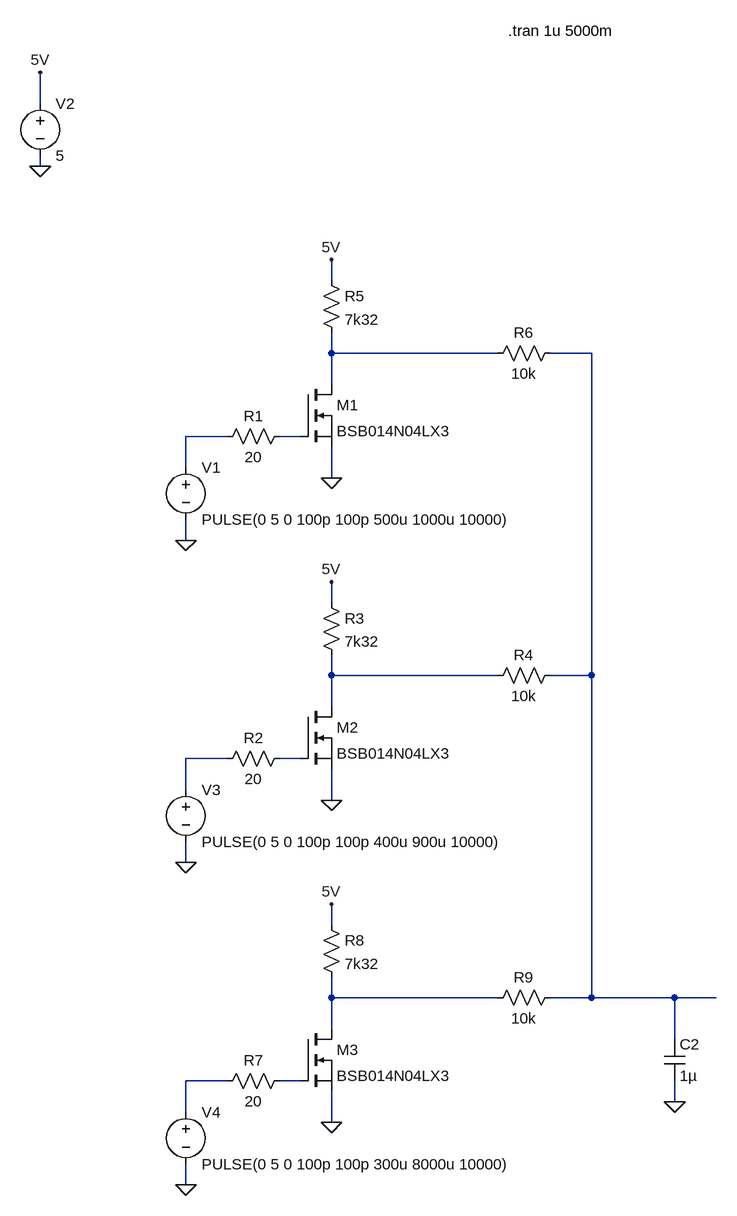
[diagram p0: schematic Fan Tachometer Combiner.asc]
Fan Tachometer Combiner.asc, the LTspice schematic file:
Version 4
SHEET 1 1076 1632
WIRE -176 -48 -176 -96
WIRE -176 48 -176 32
WIRE 272 224 272 192
WIRE 272 336 272 304
WIRE 528 336 272 336
WIRE 672 336 608 336
WIRE 272 384 272 336
WIRE 112 464 48 464
WIRE 224 464 192 464
WIRE 48 512 48 464
WIRE 272 528 272 480
WIRE 48 624 48 592
WIRE 272 720 272 688
WIRE 272 832 272 800
WIRE 528 832 272 832
WIRE 672 832 672 336
WIRE 672 832 608 832
WIRE 272 880 272 832
WIRE 112 960 48 960
WIRE 224 960 192 960
WIRE 48 1008 48 960
WIRE 272 1024 272 976
WIRE 48 1120 48 1088
WIRE 272 1216 272 1184
WIRE 272 1328 272 1296
WIRE 528 1328 272 1328
WIRE 672 1328 672 832
WIRE 672 1328 608 1328
WIRE 800 1328 672 1328
WIRE 864 1328 800 1328
WIRE 272 1376 272 1328
WIRE 800 1392 800 1328
WIRE 112 1456 48 1456
WIRE 224 1456 192 1456
WIRE 800 1488 800 1456
WIRE 48 1504 48 1456
WIRE 272 1520 272 1472
WIRE 48 1616 48 1584
FLAG 48 624 0
FLAG 272 528 0
FLAG -176 48 0
FLAG 800 1488 0
FLAG 48 1120 0
FLAG 272 1024 0
FLAG 48 1616 0
FLAG 272 1520 0
FLAG -176 -96 5V
FLAG 272 192 5V
FLAG 272 688 5V
FLAG 272 1184 5V
SYMBOL voltage 48 496 R0
SYMATTR InstName V1
SYMATTR Value PULSE(0 5 0 100p 100p 500u 1000u 10000)
SYMBOL nmos 224 384 R0
SYMATTR InstName M1
SYMATTR Value BSB014N04LX3
SYMBOL voltage -176 -64 R0
SYMATTR InstName V2
SYMATTR Value 5
SYMBOL cap 784 1392 R0
SYMATTR InstName C2
SYMATTR Value 1µ
SYMBOL res 208 448 R90
WINDOW 0 0 56 VBottom 2
WINDOW 3 32 56 VTop 2
SYMATTR InstName R1
SYMATTR Value 20
SYMBOL res 256 208 R0
SYMATTR InstName R5
SYMATTR Value 7k32
SYMBOL res 624 320 R90
WINDOW 0 0 56 VBottom 2
WINDOW 3 32 56 VTop 2
SYMATTR InstName R6
SYMATTR Value 10k
SYMBOL voltage 48 992 R0
SYMATTR InstName V3
SYMATTR Value PULSE(0 5 0 100p 100p 400u 900u 10000)
SYMBOL nmos 224 880 R0
SYMATTR InstName M2
SYMATTR Value BSB014N04LX3
SYMBOL res 208 944 R90
WINDOW 0 0 56 VBottom 2
WINDOW 3 32 56 VTop 2
SYMATTR InstName R2
SYMATTR Value 20
SYMBOL res 256 704 R0
SYMATTR InstName R3
SYMATTR Value 7k32
SYMBOL res 624 816 R90
WINDOW 0 0 56 VBottom 2
WINDOW 3 32 56 VTop 2
SYMATTR InstName R4
SYMATTR Value 10k
SYMBOL voltage 48 1488 R0
SYMATTR InstName V4
SYMATTR Value PULSE(0 5 0 100p 100p 300u 8000u 10000)
SYMBOL nmos 224 1376 R0
SYMATTR InstName M3
SYMATTR Value BSB014N04LX3
SYMBOL res 208 1440 R90
WINDOW 0 0 56 VBottom 2
WINDOW 3 32 56 VTop 2
SYMATTR InstName R7
SYMATTR Value 20
SYMBOL res 256 1200 R0
SYMATTR InstName R8
SYMATTR Value 7k32
SYMBOL res 624 1312 R90
WINDOW 0 0 56 VBottom 2
WINDOW 3 32 56 VTop 2
SYMATTR InstName R9
SYMATTR Value 10k
TEXT 544 -160 Left 2 !.tran 1u 5000m

The netlist it stands for:
* Fan Tachometer Combiner.asc
V1 N003 0 PULSE(0 5 0 100p 100p 500u 1000u 10000)
M1 N001 N004 0 0 BSB014N04LX3
V2 5V 0 5
C2 N002 0 1µ
R1 N004 N003 20
R5 5V N001 7k32
R6 N002 N001 10k
V3 N006 0 PULSE(0 5 0 100p 100p 400u 900u 10000)
M2 N005 N007 0 0 BSB014N04LX3
R2 N007 N006 20
R3 5V N005 7k32
R4 N002 N005 10k
V4 N009 0 PULSE(0 5 0 100p 100p 300u 8000u 10000)
M3 N008 N010 0 0 BSB014N04LX3
R7 N010 N009 20
R8 5V N008 7k32
R9 N002 N008 10k
.model NMOS NMOS
.model PMOS PMOS
.lib standard.mos
.tran 1u 5000m
.backanno
.end